# Altium project PS3604LR.PrjPcb (part 3 of 3)
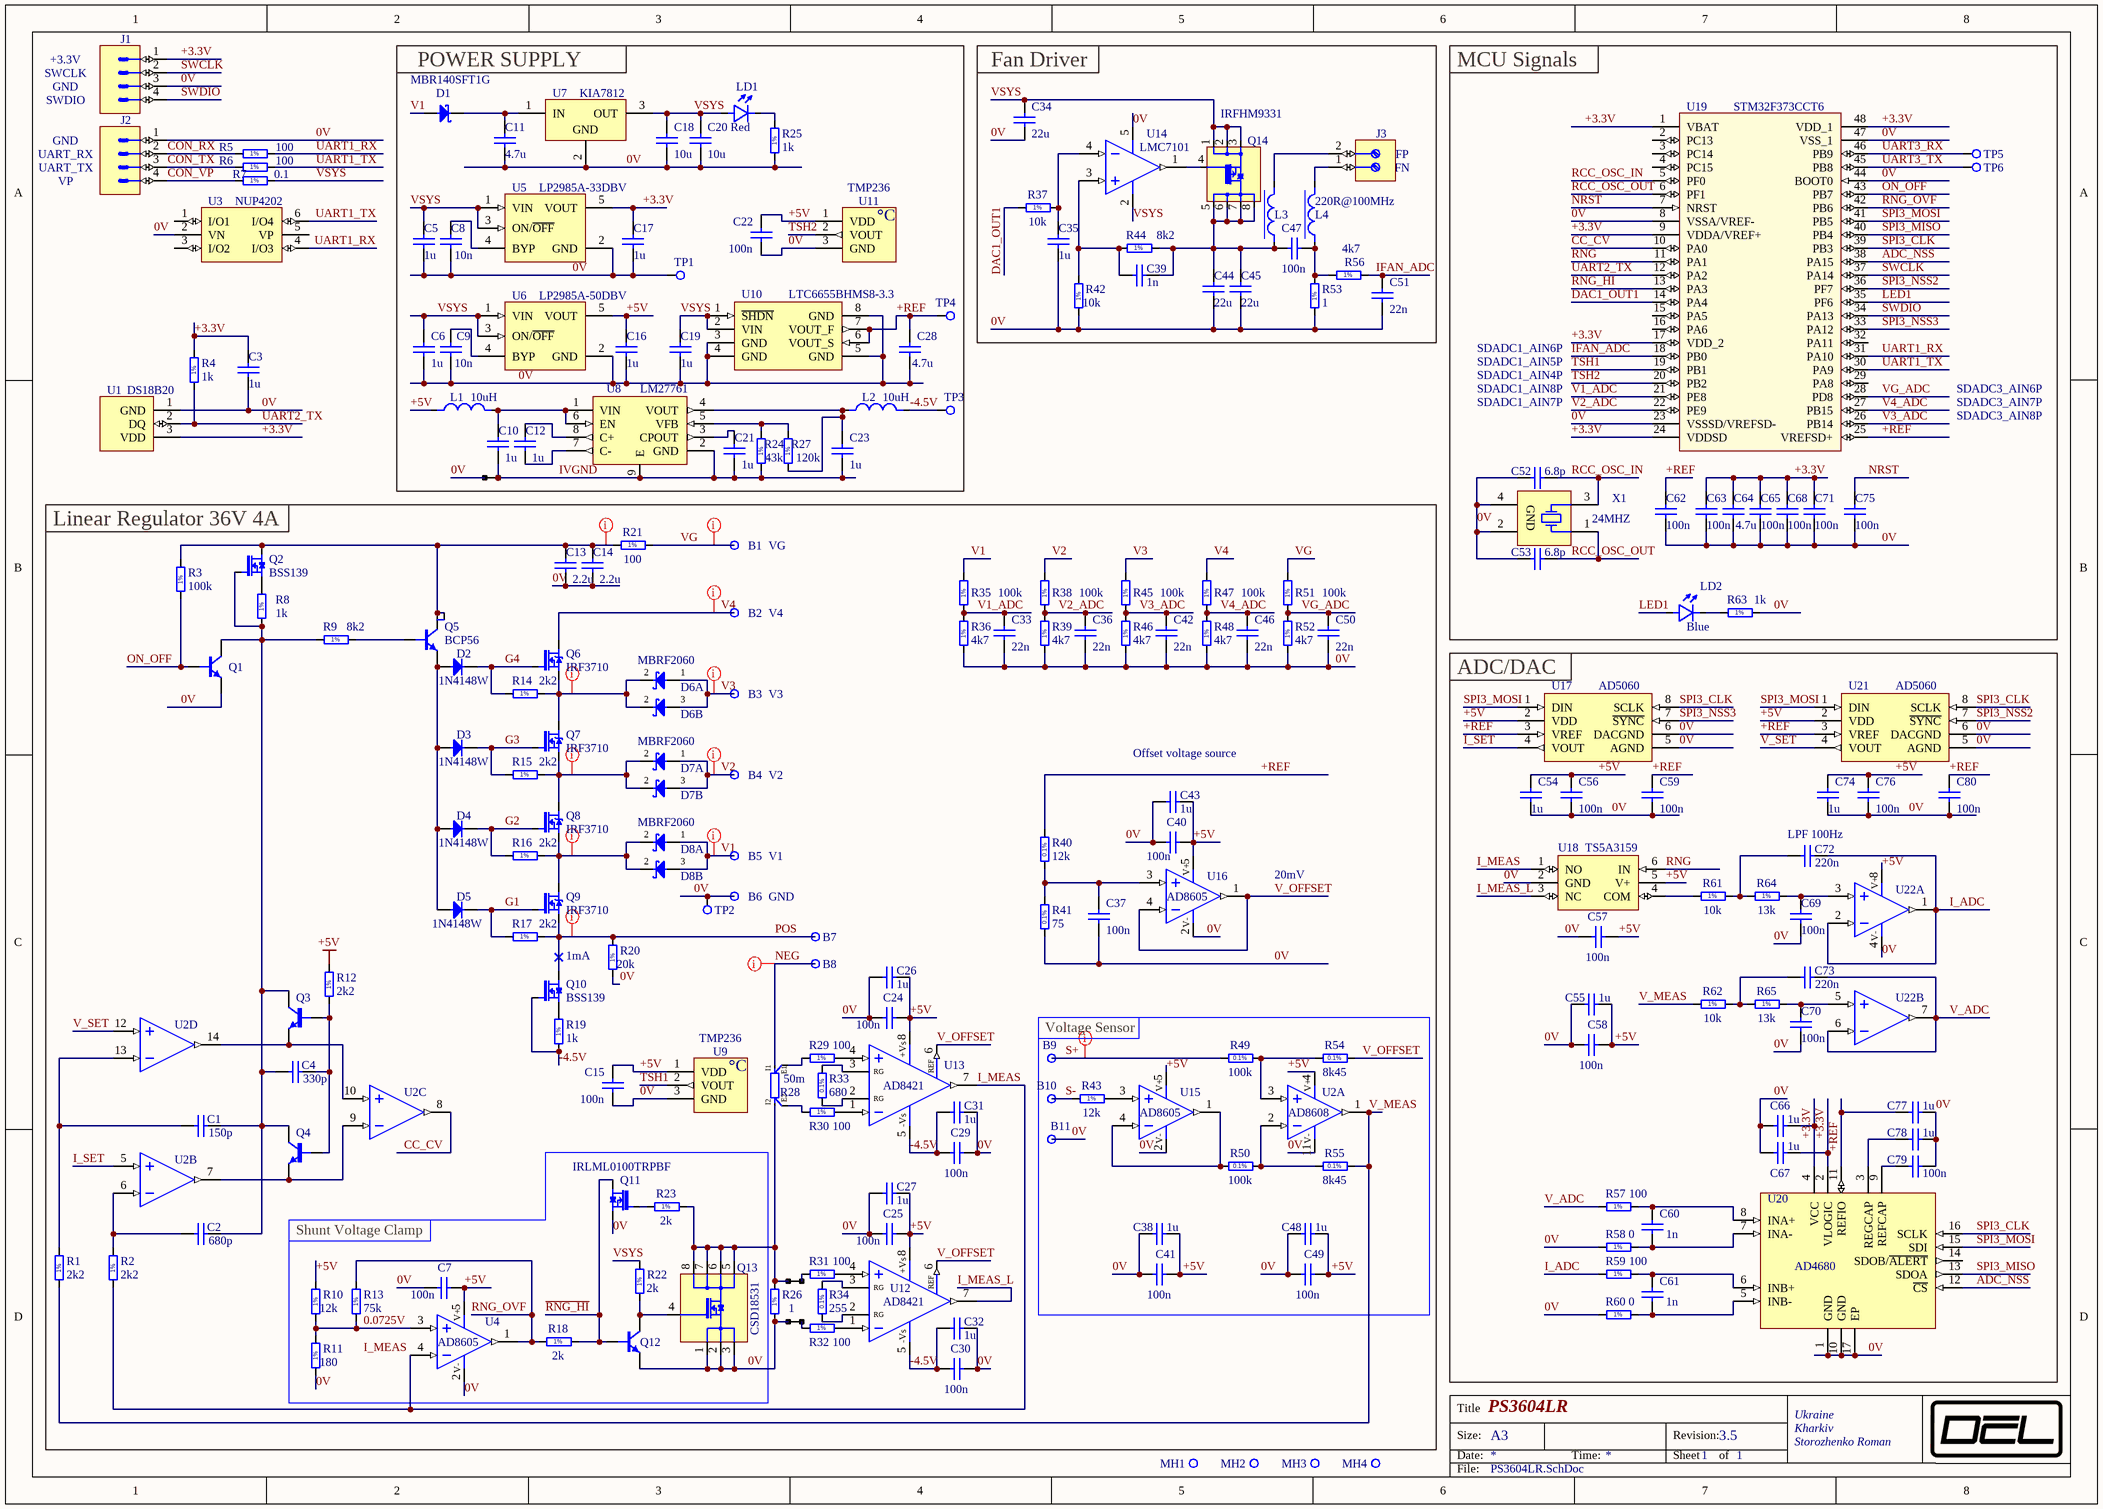
[diagram p2: PS3604LR.SchDoc]

## Sheet PS3604LR.SchDoc: PS3604LR (continued)

### Library data of the parts (continued)
U20 = AD4680: Differential Inputs, 1 MSPS/500 kSPS, Dual Simultaneous Sampling SAR ADCs; Manufacturer: ANALOG DEVICES; Manufacturer Part Number: AD4680BCPZ-RL7; Part Number: AD4680; Component Kind: Standard; Component Type: Standard; Device: AD4680; PackageDescription: QFN,0.50mm pitch,square; 4 pin X 4 pin, 3mm X 3mm X 0.80mm H body (w/thermal tab 1.2 X 1.2mm),  IPC Medium Density; Part Description: Differential Inputs, 1 MSPS/500 kSPS, Dual Simultaneous Sampling SAR ADCs; Pin Count: 16; Case: LFCSP-16; Mounted: Yes; Socket: No; SMD: Yes; ComponentHeight: 0.8mm; Author: DEL; CreateDate: 1/7/2025; LatestRevisionDate: 1/7/2025
U22 = AD8606ARMZ-REEL: Dual Operational Amplifier; Part Description: Precision, Low Noise, CMOS, Rail-to-Rail, Input/Output Operational Amplifiers; Manufacturer: ANALOG DEVICES; Part Number: AD8606ARMZ-REEL; Component Kind: Standard; Component Type: Standard; Device: AD8606; PackageDescription: SOP, 0.65mm pitch; 8 pin, 3.00mm W X 3.00mm L X 1.10mm H body, IPC Medium Density; Manufacturer Part Number: AD8606ARMZ-REEL; Pin Count: 8; Case: MSOP8; Mounted: Yes; Socket: No; SMD: Yes; ComponentHeight: 1.1mm; Author: DEL; CreateDate: 07.12.2016; LatestRevisionDate: 21.12.2017
X1 = 24MHZ_XRCGB24M000F3M00R0: Crystal 4 pins 1=XTAL 2=GND3=XTAL 4=GND; Part Description: ± 30ppm at (25±3°C), -30°C to +85°C, 6pF, Ceramic SMD Crystal, Type HCR2016; Manufacturer: MURATA; Manufacturer Part Number: 7XRCGB24M000F3M00R0; Part Number: 24MHZ_XRCGB24M000F3M00R0; Component Kind: Standard; Component Type: Standard; PackageDescription: Oscillator, corner concave; 4 pin, 2.00mm L X 1.60mm W X 0.65mm H, IPC Medium Density; Value: 24MHZ; Pin Count: 4; Mounted: Yes; Socket: No; SMD: Yes; ComponentHeight: 0.7mm; Author: D_EL; CreateDate: 17.06.2017; LatestRevisionDate: 17.06.2017